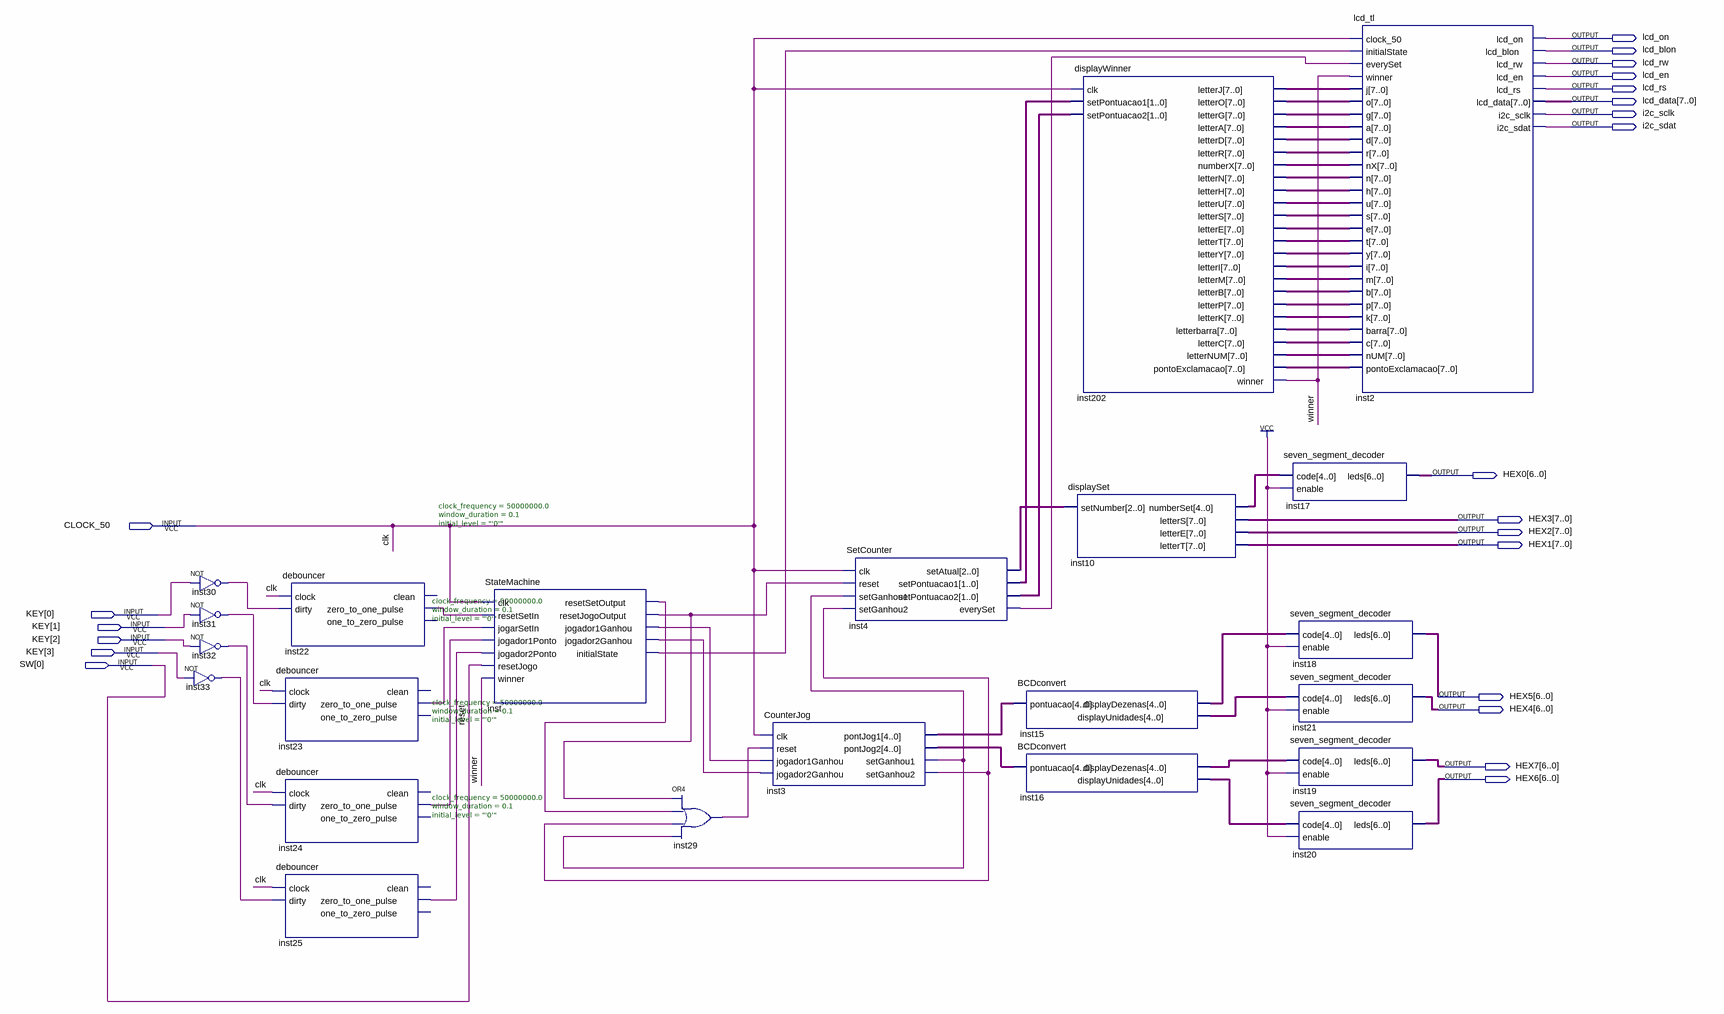
[diagram p0: schematic sheet]
// Quartus schematic Voleibol.bdf as structural Verilog: 22 symbols, 22 pins
module Voleibol (
  input  CLOCK_50,
  input  [3:0] KEY,
  input  [0:0] SW,
  output lcd_on,
  output lcd_blon,
  output lcd_rw,
  output lcd_en,
  output lcd_rs,
  output [7:0] lcd_data,
  output i2c_sclk,
  output i2c_sdat,
  output [6:0] HEX0,
  output [7:0] HEX3,
  output [7:0] HEX2,
  output [7:0] HEX1,
  output [6:0] HEX5,
  output [6:0] HEX4,
  output [6:0] HEX7,
  output [6:0] HEX6
);

  wire inst3_setganhou1, inst3_setganhou2, inst4_everyset, inst22_zero_to_one_pulse,
       inst23_zero_to_one_pulse, inst24_zero_to_one_pulse, inst25_zero_to_one_pulse, inst29_out, inst30_out,
       inst31_out, inst32_out, inst33_out, inst_initialstate, inst_jogador1ganhou, inst_jogador2ganhou,
       inst_resetjogooutput, inst_resetsetoutput, winner;
  wire [1:0] inst4_setpontuacao1, inst4_setpontuacao2;
  wire [2:0] inst4_setatual;
  wire [4:0] inst3_pontjog1, inst3_pontjog2, inst10_numberset, inst15_displaydezenas, inst15_displayunidades,
       inst16_displaydezenas, inst16_displayunidades;
  wire [7:0] inst202_lettera, inst202_letterb, inst202_letterbarra, inst202_letterc, inst202_letterd,
       inst202_lettere, inst202_letterg, inst202_letterh, inst202_letteri, inst202_letterj, inst202_letterk,
       inst202_letterm, inst202_lettern, inst202_letternum, inst202_lettero, inst202_letterp,
       inst202_letterr, inst202_letters, inst202_lettert, inst202_letteru, inst202_lettery, inst202_numberx,
       inst202_pontoexclamacao;

  not inst30 (inst30_out, KEY[0]);
  not inst31 (inst31_out, KEY[1]);
  not inst32 (inst32_out, KEY[2]);
  not inst33 (inst33_out, KEY[3]);
  debouncer #(.clock_frequency(50000000.0), .window_duration(0.1), .initial_level("'0'")) inst22 (
    .clock(CLOCK_50), .dirty(inst30_out), .zero_to_one_pulse(inst22_zero_to_one_pulse));  // open: clean, one_to_zero_pulse
  debouncer #(.clock_frequency(50000000.0), .window_duration(0.1), .initial_level("'0'")) inst23 (
    .clock(CLOCK_50), .dirty(inst31_out), .zero_to_one_pulse(inst23_zero_to_one_pulse));  // open: clean, one_to_zero_pulse
  debouncer #(.clock_frequency(50000000.0), .window_duration(0.1), .initial_level("'0'")) inst24 (
    .clock(CLOCK_50), .dirty(inst32_out), .zero_to_one_pulse(inst24_zero_to_one_pulse));  // open: clean, one_to_zero_pulse
  debouncer #(.clock_frequency(50000000.0), .window_duration(0.1), .initial_level("'0'")) inst25 (
    .clock(CLOCK_50), .dirty(inst33_out), .zero_to_one_pulse(inst25_zero_to_one_pulse));  // open: clean, one_to_zero_pulse
  StateMachine inst (
    .clk(CLOCK_50), .resetSetIn(inst22_zero_to_one_pulse), .jogarSetIn(inst23_zero_to_one_pulse),
    .jogador1Ponto(inst24_zero_to_one_pulse), .jogador2Ponto(inst25_zero_to_one_pulse), .resetJogo(SW[0]),
    .winner(winner), .resetSetOutput(inst_resetsetoutput), .resetJogoOutput(inst_resetjogooutput),
    .jogador1Ganhou(inst_jogador1ganhou), .jogador2Ganhou(inst_jogador2ganhou),
    .initialState(inst_initialstate));
  or inst29 (inst29_out, inst_resetjogooutput, inst_resetsetoutput, inst3_setganhou2, inst3_setganhou1);
  CounterJog inst3 (
    .clk(CLOCK_50), .reset(inst29_out), .jogador1Ganhou(inst_jogador1ganhou),
    .jogador2Ganhou(inst_jogador2ganhou), .pontJog1(inst3_pontjog1), .pontJog2(inst3_pontjog2),
    .setGanhou1(inst3_setganhou1), .setGanhou2(inst3_setganhou2));
  SetCounter inst4 (
    .clk(CLOCK_50), .reset(inst_resetjogooutput), .setGanhou1(inst3_setganhou1),
    .setGanhou2(inst3_setganhou2), .setAtual(inst4_setatual), .setPontuacao1(inst4_setpontuacao1),
    .setPontuacao2(inst4_setpontuacao2), .everySet(inst4_everyset));
  BCDconvert inst15 (
    .pontuacao(inst3_pontjog1), .displayDezenas(inst15_displaydezenas),
    .displayUnidades(inst15_displayunidades));
  BCDconvert inst16 (
    .pontuacao(inst3_pontjog2), .displayDezenas(inst16_displaydezenas),
    .displayUnidades(inst16_displayunidades));
  displayWinner inst202 (
    .clk(CLOCK_50), .setPontuacao1(inst4_setpontuacao1), .setPontuacao2(inst4_setpontuacao2),
    .letterJ(inst202_letterj), .letterO(inst202_lettero), .letterG(inst202_letterg),
    .letterA(inst202_lettera), .letterD(inst202_letterd), .letterR(inst202_letterr),
    .numberX(inst202_numberx), .letterN(inst202_lettern), .letterH(inst202_letterh),
    .letterU(inst202_letteru), .letterS(inst202_letters), .letterE(inst202_lettere),
    .letterT(inst202_lettert), .letterY(inst202_lettery), .letterI(inst202_letteri),
    .letterM(inst202_letterm), .letterB(inst202_letterb), .letterP(inst202_letterp),
    .letterK(inst202_letterk), .letterbarra(inst202_letterbarra), .letterC(inst202_letterc),
    .letterNUM(inst202_letternum), .pontoExclamacao(inst202_pontoexclamacao), .winner(winner));
  displaySet inst10 (
    .setNumber(inst4_setatual), .numberSet(inst10_numberset), .letterS(HEX3), .letterE(HEX2), .letterT(HEX1));
  seven_segment_decoder inst17 (.code(inst10_numberset), .enable(1'b1), .leds(HEX0));
  seven_segment_decoder inst18 (.code(inst15_displaydezenas), .enable(1'b1), .leds(HEX5));
  seven_segment_decoder inst21 (.code(inst15_displayunidades), .enable(1'b1), .leds(HEX4));
  seven_segment_decoder inst19 (.code(inst16_displaydezenas), .enable(1'b1), .leds(HEX7));
  seven_segment_decoder inst20 (.code(inst16_displayunidades), .enable(1'b1), .leds(HEX6));
  lcd_tl inst2 (
    .clock_50(CLOCK_50), .initialState(inst_initialstate), .everySet(inst4_everyset), .winner(winner),
    .j(inst202_letterj), .o(inst202_lettero), .g(inst202_letterg), .a(inst202_lettera), .d(inst202_letterd),
    .r(inst202_letterr), .nX(inst202_numberx), .n(inst202_lettern), .h(inst202_letterh), .u(inst202_letteru),
    .s(inst202_letters), .e(inst202_lettere), .t(inst202_lettert), .y(inst202_lettery), .i(inst202_letteri),
    .m(inst202_letterm), .b(inst202_letterb), .p(inst202_letterp), .k(inst202_letterk),
    .barra(inst202_letterbarra), .c(inst202_letterc), .nUM(inst202_letternum),
    .pontoExclamacao(inst202_pontoexclamacao), .lcd_on(lcd_on), .lcd_blon(lcd_blon), .lcd_rw(lcd_rw),
    .lcd_en(lcd_en), .lcd_rs(lcd_rs), .lcd_data(lcd_data), .i2c_sclk(i2c_sclk), .i2c_sdat(i2c_sdat));

  // Other names for the same wires on the sheet: clk = CLOCK_50; reset = SW[0]
endmodule
